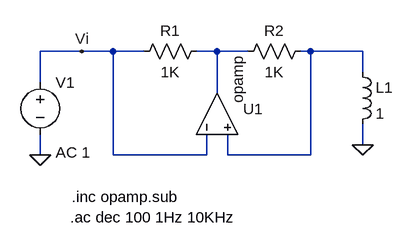
[diagram p0: schematic EJ6_NIC.asc]
EJ6_NIC.asc, the LTspice schematic file:
Version 4
SHEET 1 880 680
WIRE 16 112 -48 112
WIRE 64 112 16 112
WIRE 112 112 64 112
WIRE 224 112 192 112
WIRE 272 112 224 112
WIRE 368 112 352 112
WIRE 448 112 368 112
WIRE 448 144 448 112
WIRE -48 160 -48 112
WIRE 224 176 224 112
WIRE 448 256 448 224
WIRE -48 272 -48 240
WIRE 64 272 64 112
WIRE 208 272 208 240
WIRE 208 272 64 272
WIRE 240 272 240 240
WIRE 368 272 368 112
WIRE 368 272 240 272
FLAG 16 112 Vi
FLAG 448 256 0
FLAG -48 272 0
SYMBOL OpAmps\\opamp 160 208 R270
WINDOW 0 7 104 VRight 2
SYMATTR InstName U1
SYMBOL res 96 128 R270
WINDOW 0 32 56 VTop 2
WINDOW 3 0 56 VBottom 2
SYMATTR InstName R1
SYMATTR Value 1K
SYMBOL res 368 96 R90
WINDOW 0 0 56 VBottom 2
WINDOW 3 32 56 VTop 2
SYMATTR InstName R2
SYMATTR Value 1K
SYMBOL voltage -48 144 R0
WINDOW 123 24 124 Left 2
WINDOW 39 0 0 Left 0
SYMATTR InstName V1
SYMATTR Value ""
SYMATTR Value2 AC 1
SYMBOL ind 432 128 R0
SYMATTR InstName L1
SYMATTR Value 1
TEXT -2 368 Left 2 !.ac dec 100 1Hz 10KHz
TEXT 0 336 Left 2 !.inc opamp.sub

The netlist it stands for:
* EJ6_NIC.asc
XU1 Vi N002 N001 opamp Aol=100K GBW=10Meg  ; pins invin noninvin out
R1 Vi N001 1K
R2 N002 N001 1K
V1 Vi 0 AC 1
L1 N002 0 1
.ac dec 100 1Hz 10KHz
.inc opamp.sub
.backanno
.end